# EAGLE design Board_ESP32_V1 (EAGLE 7.2.0)
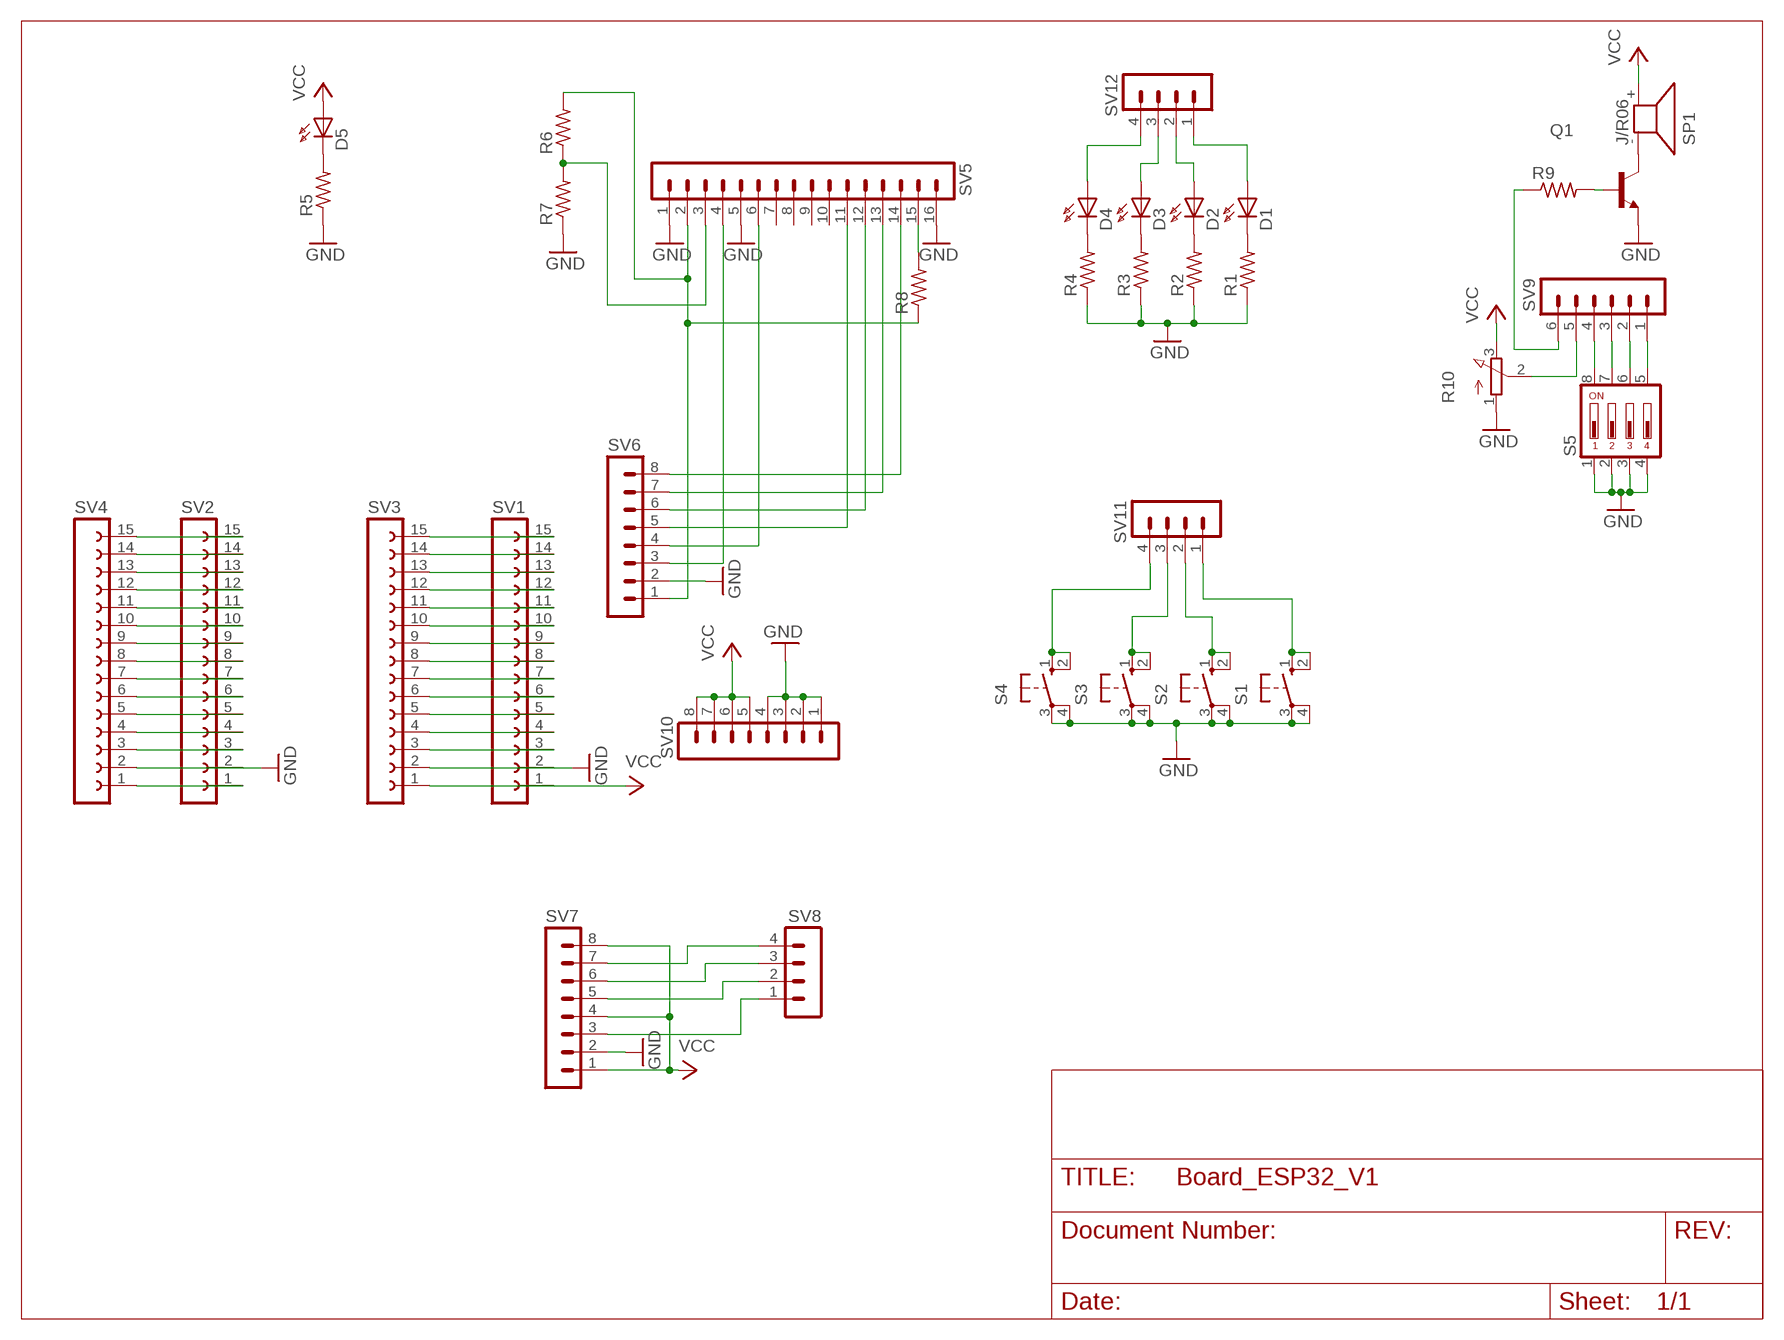
[diagram p0: schematic, sheet 1]

## Parts
D1  LED3MM  [LED3MM]
D2  LED3MM  [LED3MM]
D3  LED3MM  [LED3MM]
D4  LED3MM  [LED3MM]
D5  LED3MM  [LED3MM]
Q1  2N3904  [TO92]
R1  R-US_0207/10  [0207/10]
R2  R-US_0207/10  [0207/10]
R3  R-US_0207/10  [0207/10]
R4  R-US_0207/10  [0207/10]
R5  R-US_0207/10  [0207/10]
R6  R-US_0207/10  [0207/10]
R7  R-US_0207/10  [0207/10]
R8  R-US_0207/10  [0207/10]
R9  R-US_0207/10  [0207/10]
R10  3RP/1610N  [3RP/1610N]
S1  10-XX  [B3F-10XX]
S2  10-XX  [B3F-10XX]
S3  10-XX  [B3F-10XX]
S4  10-XX  [B3F-10XX]
S5  DIP04YL  [DIP04YL]
SP1  J/R06  [J/R06]
SV1  FE15-1  [FE15]
SV2  FE15-1  [FE15]
SV3  FE15-1  [FE15]
SV4  FE15-1  [FE15]
SV5  MA16-1  [MA16-1]
SV6  MA08-1  [MA08-1]
SV7  MA08-1  [MA08-1]
SV8  MA04-1  [MA04-1]
SV9  MA06-1  [MA06-1]
SV10  MA08-1  [MA08-1]
SV11  MA04-1  [MA04-1]
SV12  MA04-1  [MA04-1]

## Nets
GND: Q1.3(E) R1.1 R2.1 R3.1 R4.1 R5.1 R7.1 R10.1(A) S1.3(P) S1.4(P1) S2.3(P) S2.4(P1) S3.3(P) S3.4(P1) S4.3(P) S4.4(P1) S5.1 S5.2 S5.3 S5.4 SV1.2 SV2.2 SV3.2 SV4.2 SV5.1 SV5.5 SV5.16 SV6.2 SV7.2 SV10.1 SV10.2 SV10.3 SV10.4
N$1: SV5.14 SV6.8
N$2: SV5.6 SV6.4
N$3: SV5.11 SV6.5
N$4: SV5.12 SV6.6
N$5: SV5.13 SV6.7
N$6: SV5.4 SV6.3
N$7: R6.2 R8.1 SV5.2 SV6.1
N$8: D1.A SV12.1
N$9: D2.A SV12.2
N$10: D3.A SV12.3
N$11: D4.A SV12.4
N$12: SV7.3 SV8.1
N$13: SV7.5 SV8.2
N$14: SV7.6 SV8.3
N$15: SV7.7 SV8.4
N$16: D1.K(C) R1.2
N$17: D2.K(C) R2.2
N$18: D3.K(C) R3.2
N$19: D4.K(C) R4.2
N$28: S5.5 SV9.1
N$29: S5.6 SV9.2
N$30: S5.7 SV9.3
N$31: S5.8 SV9.4
N$33: S4.1(S) S4.2(S1) SV11.4
N$37: S3.1(S) S3.2(S1) SV11.3
N$38: S2.1(S) S2.2(S1) SV11.2
N$39: S1.1(S) S1.2(S1) SV11.1
N$48: R10.2(S) SV9.5
N$49: D5.K(C) R5.2
N$50: R8.2 SV5.15
N$51: R6.1 R7.2 SV5.3
N$52: Q1.1(C) SP1.-
N$53: Q1.2(B) R9.2
N$54: R9.1 SV9.6
N$55: SV2.3 SV4.3
N$56: SV2.4 SV4.4
N$57: SV2.5 SV4.5
N$58: SV2.6 SV4.6
N$59: SV2.7 SV4.7
N$60: SV2.8 SV4.8
N$61: SV2.9 SV4.9
N$62: SV2.10 SV4.10
N$63: SV2.11 SV4.11
N$64: SV2.12 SV4.12
N$65: SV2.13 SV4.13
N$66: SV2.14 SV4.14
N$67: SV2.15 SV4.15
N$68: SV2.1 SV4.1
N$78: SV1.15 SV3.15
N$79: SV1.14 SV3.14
N$80: SV1.13 SV3.13
N$81: SV1.12 SV3.12
N$82: SV1.11 SV3.11
N$83: SV1.10 SV3.10
N$84: SV1.7 SV3.7
N$85: SV1.8 SV3.8
N$86: SV1.9 SV3.9
N$134: SV1.6 SV3.6
N$135: SV1.5 SV3.5
N$136: SV1.4 SV3.4
N$137: SV1.3 SV3.3
VCC: D5.A R10.3(E) SP1.+ SV1.1 SV3.1 SV7.1 SV7.4 SV7.8 SV10.5 SV10.6 SV10.7 SV10.8
Unconnected: SV5.7 SV5.8 SV5.9 SV5.10

## Library data of the parts
D1-D5 = _JR_Personal:LED3MM: LED 3 mm, round
Q1 = transistor-npn:2N3904: NPN Transistor
R1-R9 = _JR_Personal:R-US_: RESISTOR, American symbol
R10 = pot:3RP/1610N: 16mm Potentiometer one level Source: http://www.alphapotentiometers.net/html/16mm_pot_2.html
S1-S4 = switch-omron:10-XX: OMRON SWITCH; MPN: B3F-1000; OC_FARNELL: 176432; OC_NEWARK: 36M3542
S5 = switch-dil:DIP04YL: DIL/CODE SWITCH; OC_FARNELL: unknown; OC_NEWARK: unknown
SP1 = _JR_Personal:J/R06: Buzzer 6v - 12v
SV1-SV4 = con-lsta:FE15-1: FEMALE HEADER; OC_FARNELL: unknown; OC_NEWARK: unknown
SV5 = _JR_Personal:MA16-1: PIN HEADER; OC_FARNELL: unknown; OC_NEWARK: unknown
SV6 SV7 SV10 = con-lstb:MA08-1: PIN HEADER; OC_FARNELL: unknown; OC_NEWARK: unknown
SV8 SV11 SV12 = con-lstb:MA04-1: PIN HEADER; OC_FARNELL: unknown; OC_NEWARK: unknown
SV9 = con-lstb:MA06-1: PIN HEADER; OC_FARNELL: unknown; OC_NEWARK: unknown

## Board
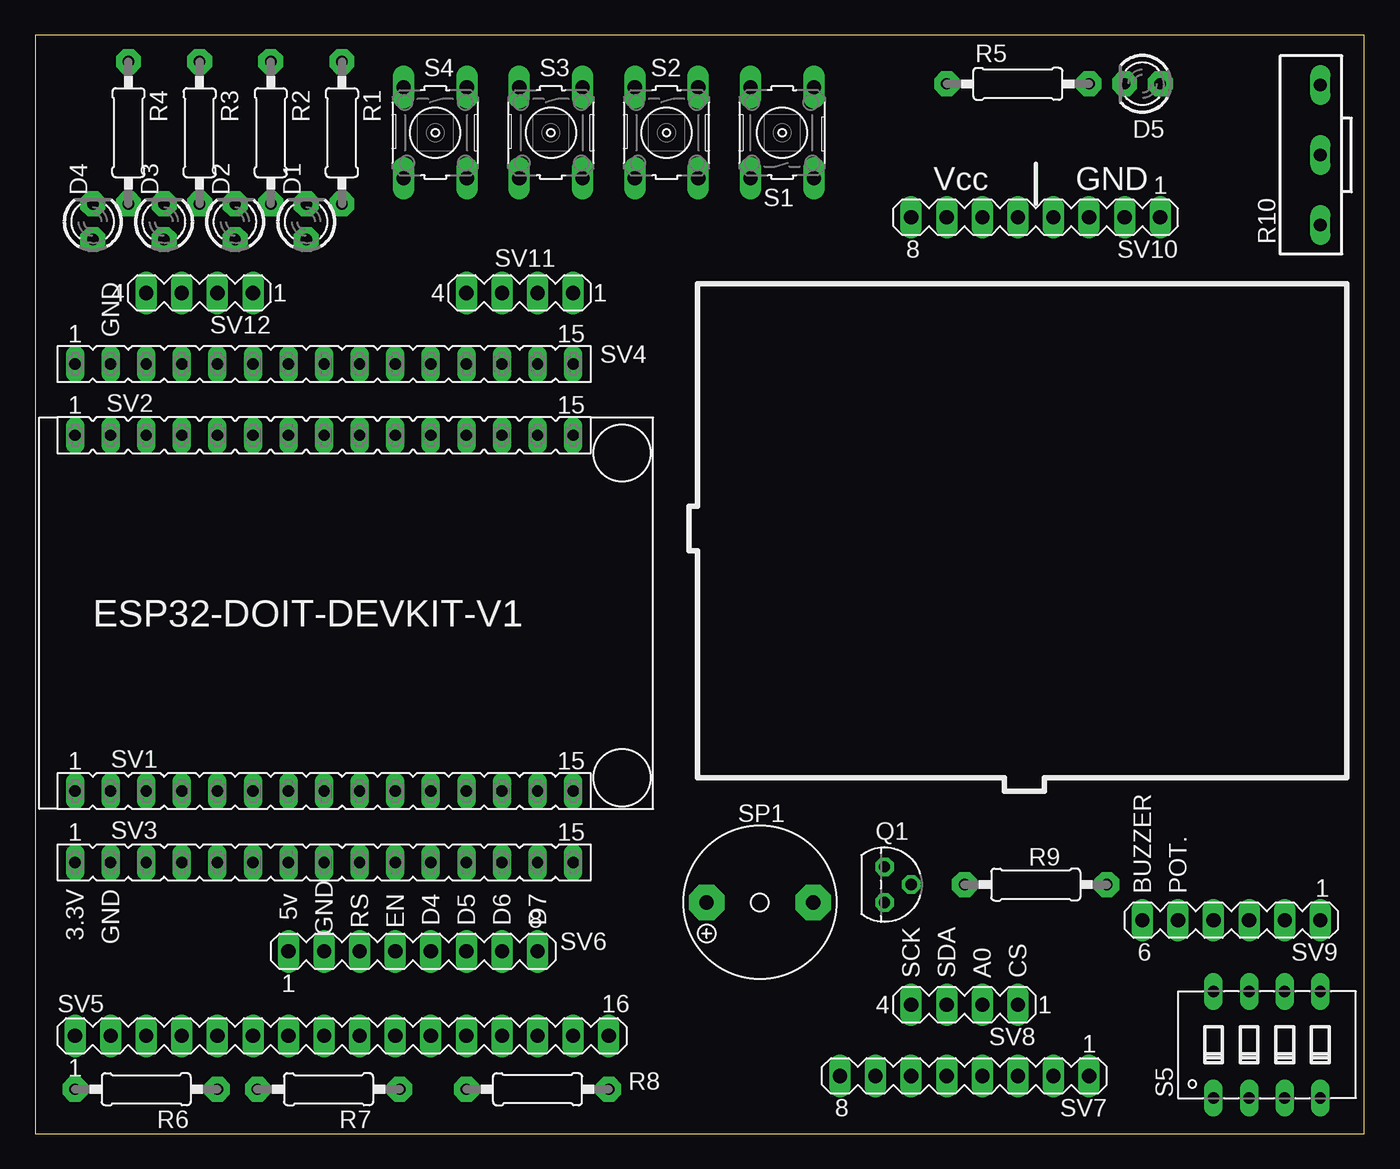
[diagram p1: board, top side]
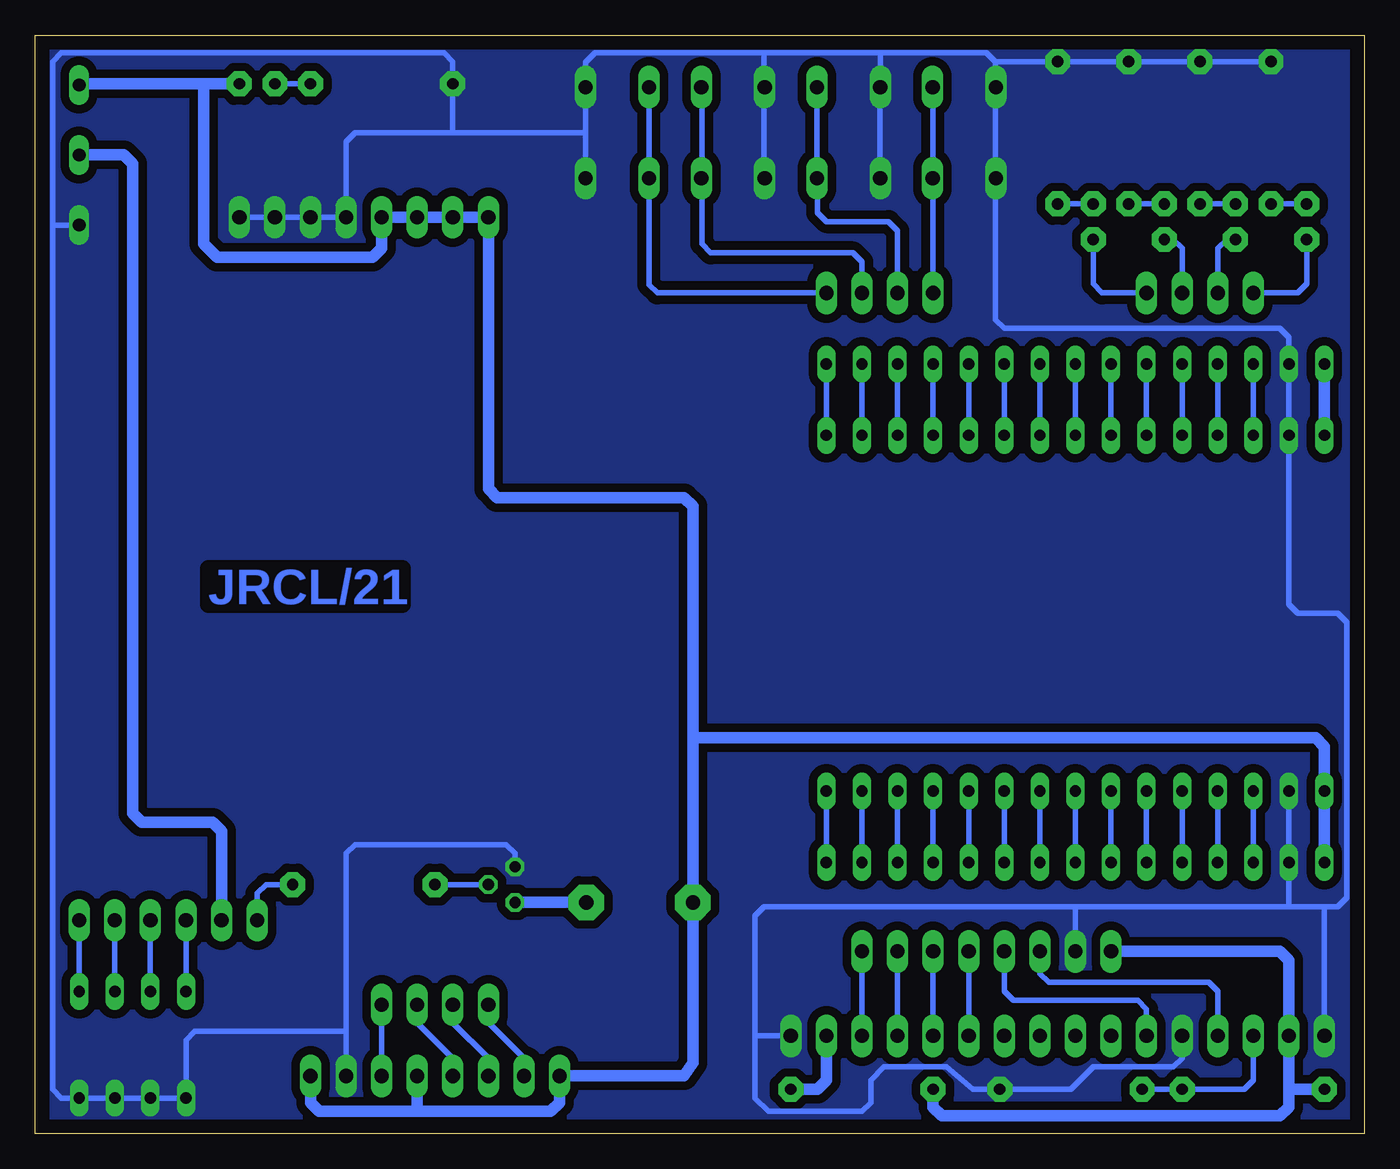
[diagram p2: board, bottom side, seen from below]

Size 94.91 x 78.41 mm. Coordinates in mm from the lower left corner, seen from the top.
Outline: 0,0 94.91,0 94.91,78.41 0,78.41 0,0
Copper layers (1*16): Top 0.035mm / dielectric 1.5mm / Bottom 0.035mm
Design rules "default *": minimum track width 16mil, minimum drill 24mil, track to track 8mil, track to pad 8mil, pad to pad 8mil, via to via 8mil, smd to smd 8mil, copper to edge 40mil, drill to drill 8mil, minimum pad ring 10mil, minimum via ring 8mil, stop-mask expansion 4mil, vias tented up to drill 0mil, thermal gap 10mil

### Footprints (pad centres in the part's own frame; a part is rotated, then mirrored left to right if it is on the bottom)
LED3MM = drill 0.813 pad 1.778 octagon: A -1.27,0; K 1.27,0
TO92 = drill 0.813 octagon: 1 1.27,0; 2 0,1.905; 3 -1.27,0
0207/10 = drill 0.813 pad 1.778 octagon: 1 -5.08,0; 2 5.08,0
3RP/1610N = drill 0.9 pad 1.422 long: 1 -5,-1.27; 2 0,-1.27; 3 5,-1.27
B3F-10XX = drill 1.016 long: 1 -3.251,2.261; 2 3.251,2.261; 3 -3.251,-2.261; 4 3.251,-2.261
DIP04YL = drill 0.813 long: 1 -3.81,-3.81; 2 -1.27,-3.81; 3 1.27,-3.81; 4 3.81,-3.81; 5 3.81,3.81; 6 1.27,3.81; 7 -1.27,3.81; 8 -3.81,3.81
J/R06 = drill 1.016 pad 2.54 octagon: + 3.81,0; - -3.81,0
FE15 = drill 0.813 long: 1 -17.78,0; 2 -15.24,0; 3 -12.7,0; 4 -10.16,0; 5 -7.62,0; 6 -5.08,0; 7 -2.54,0; 8 0,0; 9 2.54,0; 10 5.08,0; 11 7.62,0; 12 10.16,0; 13 12.7,0; 14 15.24,0; 15 17.78,0
MA16-1 = drill 1.016 long: 1 -15.24,0; 2 -12.7,0; 3 -10.16,0; 4 -7.62,0; 5 -5.08,0; 6 -2.54,0; 7 0,0; 8 2.54,0; 9 5.08,0; 10 7.62,0; 11 10.16,0; 12 12.7,0; 13 15.24,0; 14 17.78,0; 15 20.32,0; 16 22.86,0
MA08-1 = drill 1.016 long: 1 -8.89,0; 2 -6.35,0; 3 -3.81,0; 4 -1.27,0; 5 1.27,0; 6 3.81,0; 7 6.35,0; 8 8.89,0
MA04-1 = drill 1.016 long: 1 -3.81,0; 2 -1.27,0; 3 1.27,0; 4 3.81,0
MA06-1 = drill 1.016 long: 1 -6.35,0; 2 -3.81,0; 3 -1.27,0; 4 1.27,0; 5 3.81,0; 6 6.35,0

### Placement (x,y rotation side)
D1  19.37,65.09 90 top
D2  14.29,65.09 90 top
D3  9.21,65.09 90 top
D4  4.13,65.09 90 top
D5  79.06,74.93 180 top
Q1  60.64,17.78 270 top
R1  21.91,71.44 270 top
R2  16.83,71.44 270 top
R3  11.75,71.44 270 top
R4  6.67,71.44 270 top
R5  70.17,74.93 0 top
R6  7.94,3.17 180 top
R7  20.95,3.17 180 top
R8  35.88,3.17 0 top
R9  71.44,17.78 180 top
R10  90.49,69.85 90 top
S1  53.34,71.44 90 top
S2  45.09,71.44 270 top
S3  36.83,71.44 270 top
S4  28.57,71.44 270 top
S5  87.95,6.35 0 top
SP1  51.75,16.51 180 top
SV1  20.64,24.45 0 top
SV2  20.64,49.85 0 top
SV3  20.64,19.37 0 top
SV4  20.64,54.93 0 top
SV5  18.1,6.99 0 top
SV6  26.99,13.02 0 top
SV7  66.36,4.13 180 top
SV8  66.36,9.21 180 top
SV9  85.41,15.24 180 top
SV10  71.44,65.41 180 top
SV11  34.61,60.01 180 top
SV12  11.75,60.01 180 top

### Tracks (layer width: path | path; a pad name or v marks a point on that pad's centre or on a via)
GND
  Bottom 0.406: S3.4 34.61,68.26 34.61,74.61 S3.3 34.57,77.11 | S2.4 42.86,68.26 42.86,74.61 | S2.3 42.86,74.61 | 26.35,74.61 26.35,68.26 S4.4 26.35,68.15 26.35,58.1 25.72,57.47 6.03,57.47 5.4,56.83 SV4.2 SV2.2 5.4,37.78 4.76,37.15 1.91,37.15 1.27,36.51 1.27,16.83 1.91,16.19 2.86,16.19 | S4.3 26.35,74.61 | R4.1 R3.1 R2.1 R1.1 26.35,76.52 | SV10.1 SV10.2 SV10.3 SV10.4 72.71,70.8 72.07,71.44 65.09,71.44 | SV5.5 13.02,5.4 13.65,4.76 19.37,4.76 20.95,3.17 R7.1 27.94,3.17 29.84,4.76 34.29,4.76 35.24,3.81 35.24,2.22 35.88,1.59 42.55,1.59 43.5,2.54 43.5,6.99 | SV5.1 2.86,16.19 | SV5.16 43.5,6.99 | 43.5,6.99 43.5,15.56 42.86,16.19 20.64,16.19 | 20.64,16.19 5.4,16.19 | 5.4,16.19 2.86,16.19 | SV1.2 SV3.2 5.4,16.19 | 65.09,71.44 55.6,71.44 | 55.6,71.44 S1.4 55.6,76.48 54.93,77.15 42.86,77.15 | 55.6,71.44 S1.3 | 42.86,77.15 42.86,74.61 | 42.86,77.15 34.61,77.15 34.57,77.11 | 26.35,74.61 26.35,76.52 | 34.57,77.11 34.53,77.15 26.99,77.15 26.35,76.52 | 72.71,7.3 83.5,7.3 84.14,6.67 S5.1 S5.2 S5.3 S5.4 93.03,2.54 93.66,3.17 93.66,64.77 | 72.71,7.3 SV7.2 | Q1.3 60.64,20 61.28,20.64 72.07,20.64 72.71,20 72.71,7.3 | 65.09,71.44 R5.1 65.09,76.52 65.72,77.15 93.03,77.15 93.66,76.52 93.66,64.77 | R10.1 93.58,64.85 93.66,64.77 | SV6.2 20.64,16.19
  pour Bottom (isolate 0.61, no thermals): 0,78.42 94.93,78.42 94.93,0 0,0
N$1
  Bottom 0.406: SV6.8 SV5.14
N$2
  Bottom 0.406: SV5.6 15.56,8.89 16.19,9.53 25.08,9.53 25.72,10.16 SV6.4
N$3
  Bottom 0.406: SV6.5 SV5.11
N$4
  Bottom 0.406: SV6.6 SV5.12
N$5
  Bottom 0.406: SV6.7 SV5.13
N$6
  Bottom 0.406: SV5.4 10.48,10.16 11.11,10.79 22.54,10.79 23.18,11.43 SV6.3
N$7
  Bottom 0.813: 5.4,3.17 SV5.2 5.4,12.38 6.03,13.02 SV6.1 | 5.4,3.17 R6.2 | R8.1 30.8,1.91 30.16,1.27 6.03,1.27 5.4,1.91 5.4,3.17
N$8
  Bottom 0.406: SV12.1 18.73,60.01 19.37,60.64 D1.A
N$9
  Bottom 0.406: D2.A 13.65,63.82 13.02,63.18 SV12.2
N$10
  Bottom 0.406: D3.A 9.84,63.82 10.48,63.18 SV12.3
N$11
  Bottom 0.406: SV12.4 4.76,60.01 4.13,60.64 D4.A
N$12
  Bottom 0.406: SV7.3 SV8.1
N$13
  Bottom 0.406: SV7.5 65.09,5.4 67.63,7.94 SV8.2
N$14
  Bottom 0.406: SV7.6 62.55,5.4 65.09,7.94 SV8.3
N$15
  Bottom 0.406: SV7.7 60.01,5.4 62.55,7.94 SV8.4
N$16
  Bottom 0.406: D1.K R1.2
N$17
  Bottom 0.406: D2.K R2.2
N$18
  Bottom 0.406: D3.K R3.2
N$19
  Bottom 0.406: D4.K R4.2
N$28
  Bottom 0.406: S5.5 SV9.1
N$29
  Bottom 0.406: S5.6 SV9.2
N$30
  Bottom 0.406: S5.7 SV9.3
N$31
  Bottom 0.406: S5.8 SV9.4
N$33
  Bottom 0.406: S4.1 30.8,74.61 30.8,68.26 S4.2 30.8,68.15 SV11.4
N$37
  Bottom 0.406: SV11.3 33.34,64.45 33.97,65.09 38.42,65.09 39.05,65.72 39.05,68.15 S3.2 S3.1
N$38
  Bottom 0.406: SV11.2 35.88,62.23 36.51,62.87 46.67,62.87 47.31,63.5 47.31,68.26 | 47.31,68.26 47.31,74.3 S2.1 | 47.31,68.26 S2.2
N$39
  Bottom 0.406: SV11.1 50.48,60.01 51.08,60.6 S1.1 S1.2
N$48
  Bottom 0.813: R10.2 88.58,69.85 87.95,69.22 87.95,22.86 87.31,22.23 82.23,22.23 81.6,21.59 SV9.5
N$49
  Bottom 0.406: R5.2 D5.K
N$50
  Bottom 0.813: R8.2 39.05,3.17 38.42,3.81 SV5.15
N$51
  Bottom 0.406: SV5.3 7.94,3.81 8.57,3.17 R6.1 R7.2
N$52
  Bottom 0.813: SP1.- Q1.1
N$53
  Bottom 0.406: R9.2 Q1.2
N$54
  Bottom 0.406: SV9.6 79.06,17.14 78.42,17.78 R9.1
N$55
  Bottom 0.406: SV4.3 SV2.3
N$56
  Bottom 0.406: SV4.4 SV2.4
N$57
  Bottom 0.406: SV4.5 SV2.5
N$58
  Bottom 0.406: SV4.6 SV2.6
N$59
  Bottom 0.406: SV4.7 SV2.7
N$60
  Bottom 0.406: SV4.8 SV2.8
N$61
  Bottom 0.406: SV4.9 SV2.9
N$62
  Bottom 0.406: SV4.10 SV2.10
N$63
  Bottom 0.406: SV4.11 SV2.11
N$64
  Bottom 0.406: SV4.12 SV2.12
N$65
  Bottom 0.406: SV4.13 SV2.13
N$66
  Bottom 0.406: SV4.14 SV2.14
N$67
  Bottom 0.406: SV4.15 SV2.15
N$68
  Bottom 0.813: SV4.1 SV2.1
N$78
  Bottom 0.406: SV1.15 SV3.15
N$79
  Bottom 0.406: SV1.14 SV3.14
N$80
  Bottom 0.406: SV1.13 SV3.13
N$81
  Bottom 0.406: SV1.12 SV3.12
N$82
  Bottom 0.406: SV1.11 SV3.11
N$83
  Bottom 0.406: SV1.10 SV3.10
N$84
  Bottom 0.406: SV1.7 SV3.7
N$85
  Bottom 0.406: SV1.8 SV3.8
N$86
  Bottom 0.406: SV1.9 SV3.9
N$134
  Bottom 0.406: SV1.6 SV3.6
N$135
  Bottom 0.406: SV1.5 SV3.5
N$136
  Bottom 0.406: SV1.4 SV3.4
N$137
  Bottom 0.406: SV1.3 SV3.3
VCC
  Bottom 0.813: 47.94,28.26 47.94,44.77 48.58,45.4 61.91,45.4 62.55,46.04 SV10.8 SV10.7 SV10.6 SV10.5 70.17,63.18 70.8,62.55 81.92,62.55 82.87,63.5 82.87,74.93 | 47.94,28.26 SP1.+ 47.94,5.08 48.58,4.13 SV7.8 57.47,2.22 58.1,1.59 67.63,1.59 | SV7.1 75.25,2.22 74.61,1.59 67.63,1.59 | SV7.4 67.63,1.59 | D5.A 82.87,74.93 | 82.87,74.93 91.52,74.93 R10.3 | SV3.1 SV1.1 2.86,27.62 3.49,28.26 47.94,28.26

### Text on the board
Bottom: JRCL/21
tPlace: Vcc | GND | GND | GND | 3.3V | GND | 5v | RS | EN | D4 | D5 | D6 | D7 | BUZZER | POT. | SCK | SDA | A0 | CS
tNames: ESP32-DOIT-DEVKIT-V1